# Altium project MAX3420E_DevBoard.PrjPcb
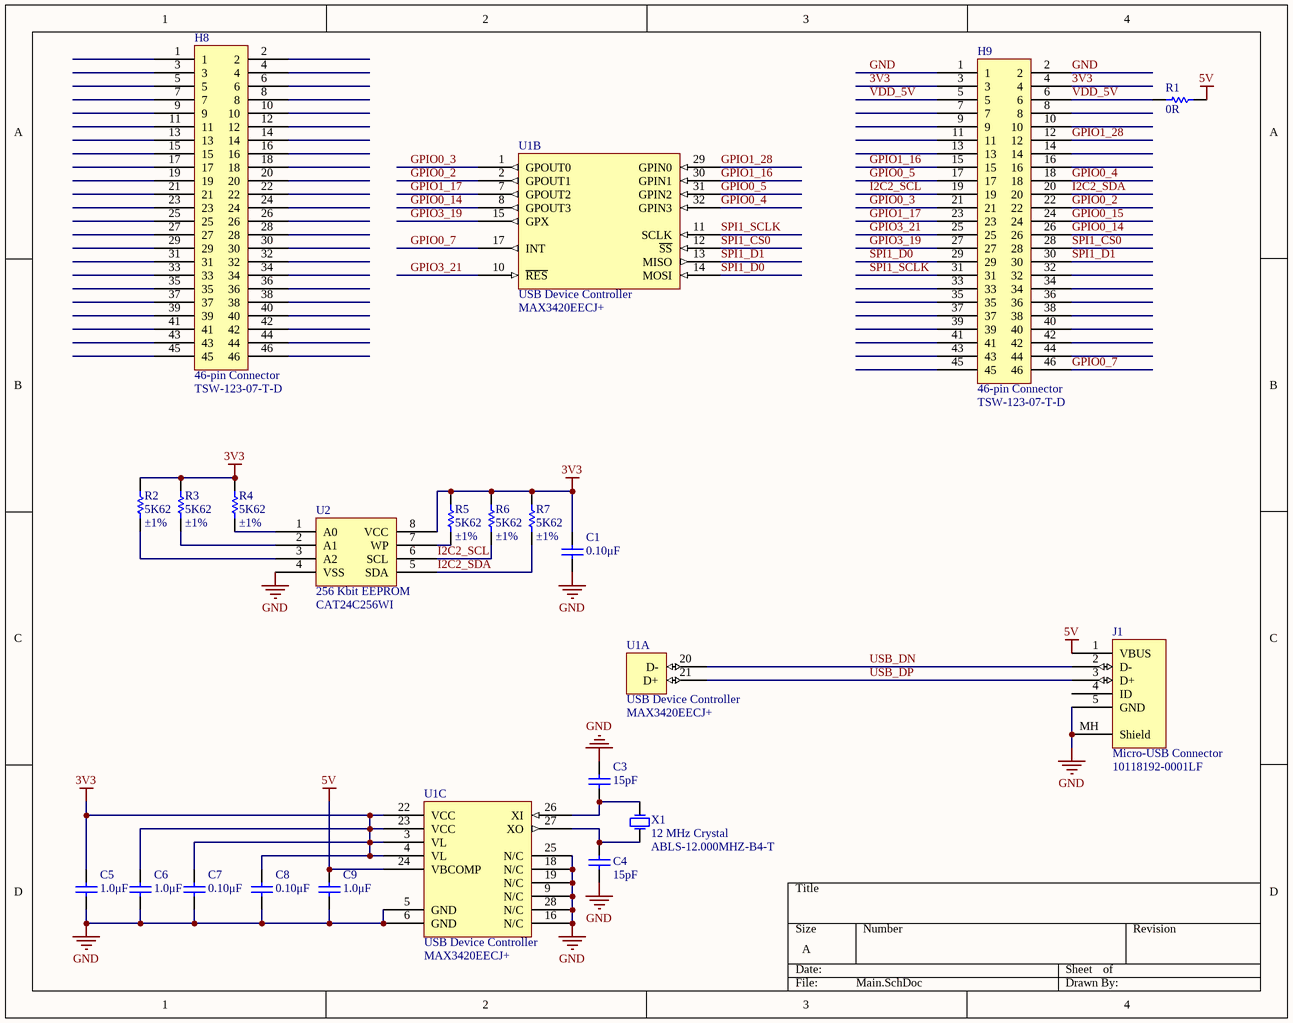
[diagram p0: Main.SchDoc]
1 sheet, 21 parts. Net scope: global (net labels, ports and power ports of the same name join across sheets).

## Sheet Main.SchDoc
size A

### Parts
C1  0.10μF  [0805_100]
C3  15pF  [0805_100]
C4  15pF  [0805_100]
C5  1.0μF  [0805_100]
C6  1.0μF  [0805_100]
C7  0.10μF  [0805_100]
C8  0.10μF  [0805_100]
C9  1.0μF  [0805_100]
H8  46-pin Connector  [TSW-123-07-X-S]
H9  46-pin Connector  [TSW-123-07-X-S]
J1  Micro-USB Connector  [10118192]
R1  0R  [0805_75]
R2  5K62  Tolerance: ±1%  [0805_75]
R3  5K62  Tolerance: ±1%  [0805_75]
R4  5K62  Tolerance: ±1%  [0805_75]
R5  5K62  Tolerance: ±1%  [0805_75]
R6  5K62  Tolerance: ±1%  [0805_75]
R7  5K62  Tolerance: ±1%  [0805_75]
U1  USB Device Controller  PartNumber: MAX3420EECJ+  [C32+1]  (parts A,B,C of 3)
U2  256 Kbit EEPROM  [SOIC-8]
X1  12 MHz Crystal  [ABLS]

### Nets
3V3: C1.2 C5.2 C6.2 C7.2 C8.2 H9.3 H9.4 R2.2 R3.2 R4.2 R5.2 R6.2 R7.2 U1.3(VL) U1.4(VL) U1.22(VCC) U1.23(VCC) U2.8(VCC)
5V: C9.2 J1.1(VBUS) R1.1 U1.24(VBCOMP)
GND: C1.1 C3.2 C4.1 C5.1 C6.1 C7.1 C8.1 C9.1 H9.1 H9.2 J1.5(GND) J1.MH(Shield) U1.5(GND) U1.6(GND) U1.9(N/C) U1.16(N/C) U1.18(N/C) U1.19(N/C) U1.25(N/C) U1.28(N/C) U2.4(VSS)
GPIO0_2: H9.22 U1.2(GPOUT1)
GPIO0_3: H9.21 U1.1(GPOUT0)
GPIO0_4: H9.18 U1.32(GPIN3)
GPIO0_5: H9.17 U1.31(GPIN2)
GPIO0_7: H9.46 U1.17(INT)
GPIO0_14: H9.26 U1.8(GPOUT3)
GPIO0_15: H9.24
GPIO1_16: H9.15 U1.30(GPIN1)
GPIO1_17: H9.23 U1.7(GPOUT2)
GPIO1_28: H9.12 U1.29(GPIN0)
GPIO3_19: H9.27 U1.15(GPX)
GPIO3_21: H9.25 U1.10(~{RES})
I2C2_SCL: H9.19 R6.1 U2.6(SCL)
I2C2_SDA: H9.20 R7.1 U2.5(SDA)
SPI1_CS0: H9.28 U1.12(~{SS})
SPI1_D0: H9.29 U1.14(MOSI)
SPI1_D1: H9.30 U1.13(MISO)
SPI1_SCLK: H9.31 U1.11(SCLK)
USB_DN: J1.2(D-) U1.20(D-)
USB_DP: J1.3(D+) U1.21(D+)
VDD_5V: H9.5 H9.6 R1.2
NetC3_1: C3.1 U1.26(XI) X1.2(X2)
NetC4_2: C4.2 U1.27(XO) X1.1(X1)
NetR2_1: R2.1 U2.3(A2)
NetR3_1: R3.1 U2.2(A1)
NetR4_1: R4.1 U2.1(A0)
NetR5_1: R5.1 U2.7(WP)

Not connected (* = marked no-connect by the designer): H8 1 2 3 4 5 6 7 8 9 10 11 12 13 14 15 16 17 18 19 20 21 22 23 24 25 26 27 28 29 30 31 32 33 34 35 36 37 38 39 40 41 42 43 44 45 46; H9 7 8 9 10 11 13 14 16 32 33 34 35 36 37 38 39 40 41 42 43 44 45; J1 4(ID)

### Library data of the parts
C1 C7 C8 = GRM21BR71C104KA01#: CAP 0.10μF  0805 16V   ±10%    X7R; Manufacturer: Murata; Case-Metric: 2012; Case-EIA: 0805; PartNumber: GRM21BR71C104KA01#; Supplier 1: Mouser; Supplier Part Number 1: 81-GRM21BR71C104KA1L; Supplier 2: Digi-Key; Value: 0.10μF; Tolerance: ±10%; Rated Voltage: 16V; Dielectric: X7R
C3 C4 = GRM21A5C2E150JW01#: CAP 15pF     0805 250V  ±5%     C0G; Manufacturer: Murata; Case-Metric: 2012; Case-EIA: 0805; PartNumber: GRM21A5C2E150JW01#; Supplier 1: Mouser; Supplier Part Number 1: 81-GRM21A5C2E150JW1D; Supplier 2: Digi-Key; Supplier Part Number 2: 490-5532-1-ND; Value: 15pF; Tolerance: ±5%; Rated Voltage: 250V; Dielectric: C0G
C5 C6 C9 = GRM21BR71C105KA01#: CAP 1.0μF   0805 16V   ±10%    X7R; Manufacturer: Murata; Case-Metric: 2012; Case-EIA: 0805; PartNumber: GRM21BR71C105KA01#; Supplier 1: Mouser; Supplier Part Number 1: 81-GRM40X105K16K; Supplier 2: Digi-Key; Supplier Part Number 2: 490-11597-1-ND; Value: 1.0μF; Tolerance: ±10%; Rated Voltage: 16V; Dielectric: X7R
H8 H9 = TSW-123-07-T-D: 46-pin Dual Row 100-mil Headers; Manufacturer: Samtec; PartNumber: TSW-123-07-T-D
J1 = 10118192-0001LF: Surface-mount USB 2.0 Micro-B Connector with Flange; Manufacturer: Amphenol; PartNumber: 10118192-0001LF
R1 = ERJ-6GEY0R00V: RES 0R 0805 2 A; Manufacturer: Panasonic; Case (EIA): 0805; Case (Metric): 2012; Current Rating: 2 A; Value: 0R; PartNumber: ERJ-6GEY0R00V; Supplier 1: Mouser; Supplier Part Number 1: 667-ERJ-6GEY0R00V; Supplier 2: Digi-Key; Supplier Part Number 2: P0.0ACT-ND
R2-R7 = ERJ-6ENF5621V: RES 5K62 0805 ±1%; Manufacturer: Panasonic; Case (EIA): 0805; Case (Metric): 2012; TCR: ±200ppm; Power Rating: 0.125 W; Value: 5K62; Supplier 1: Mouser; Supplier Part Number 1: 667-ERJ-6ENF5621V; PartNumber: ERJ-6ENF5621V; Supplier 2: Digi-Key; Supplier Part Number 2: P5.62KCCT-ND
U1 = MAX3420EEJC+: USB Peripheral Controller with SPI Interface; Manufacturer: Maxim IC
U2 = CAT24C256WI: 256 Kbit EEPROM Memory - I2C; Manufacturer: ON-Semiconductor; PartNumber: CAT24C256WI
X1 = ABLS-12.000MHZ-B4-T: 12 MHz 20 ppm Crystal; Manufacturer: Abracon; PartNumber: ABLS-12.000MHZ-B4-T